# EAGLE design l293d (EAGLE 8.0.1)
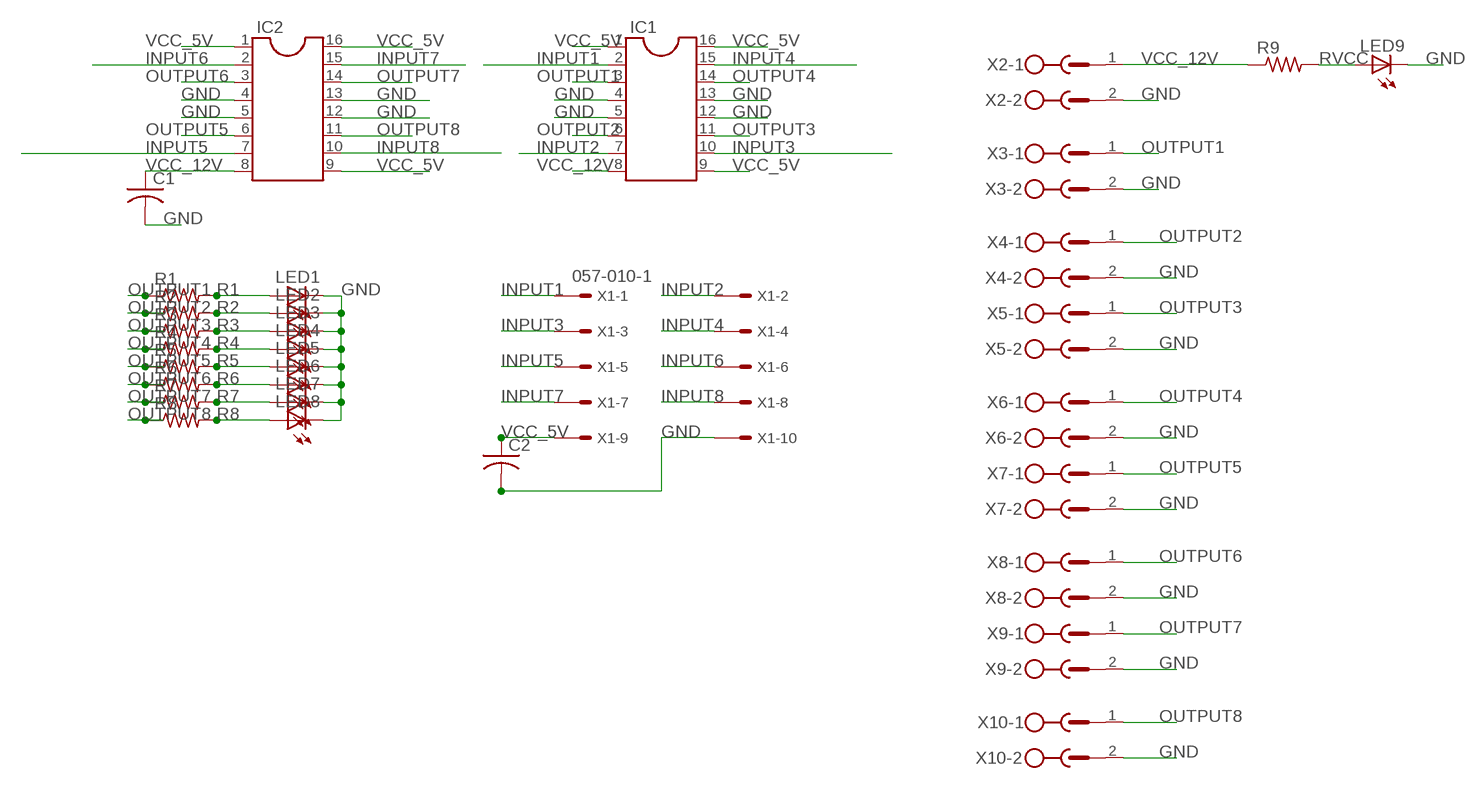
[diagram p0: schematic, sheet 1]

## Parts
C1  C-US050-025X075  [C050-025X075]
C2  C-US050-025X075  [C050-025X075]
IC1  DIL16S  [SOCKET-16]
IC2  DIL16S  [SOCKET-16]
LED1  LED3MM  [LED3MM]
LED2  LED3MM  [LED3MM]
LED3  LED3MM  [LED3MM]
LED4  LED3MM  [LED3MM]
LED5  LED3MM  [LED3MM]
LED6  LED3MM  [LED3MM]
LED7  LED3MM  [LED3MM]
LED8  LED3MM  [LED3MM]
LED9  LED3MM  [LED3MM]
R1  R-US_0204/7  [0204/7]
R2  R-US_0204/7  [0204/7]
R3  R-US_0204/7  [0204/7]
R4  R-US_0204/7  [0204/7]
R5  R-US_0204/7  [0204/7]
R6  R-US_0204/7  [0204/7]
R7  R-US_0204/7  [0204/7]
R8  R-US_0204/7  [0204/7]
R9  R-US_0204/7  [0204/7]
X1  057-010-1  [057-010-1]
X2  MSTBV2  [MSTBV2]
X3  MSTBV2  [MSTBV2]
X4  MSTBV2  [MSTBV2]
X5  MSTBV2  [MSTBV2]
X6  MSTBV2  [MSTBV2]
X7  MSTBV2  [MSTBV2]
X8  MSTBV2  [MSTBV2]
X9  MSTBV2  [MSTBV2]
X10  MSTBV2  [MSTBV2]

## Nets
GND: C1.2 C2.2 IC1.4 IC1.5 IC1.12 IC1.13 IC2.4 IC2.5 IC2.12 IC2.13 LED1.K(C) LED2.K(C) LED3.K(C) LED4.K(C) LED5.K(C) LED6.K(C) LED7.K(C) LED8.K(C) LED9.K(C) X1.10 X2.2 X3.2 X4.2 X5.2 X6.2 X7.2 X8.2 X9.2 X10.2
INPUT1: IC1.2 X1.1
INPUT2: IC1.7 X1.2
INPUT3: IC1.10 X1.3
INPUT4: IC1.15 X1.4
INPUT5: IC2.7 X1.5
INPUT6: IC2.2 X1.6
INPUT7: IC2.15 X1.7
INPUT8: IC2.10 X1.8
OUTPUT1: IC1.3 R1.1 X3.1
OUTPUT2: IC1.6 R2.1 X4.1
OUTPUT3: IC1.11 R3.1 X5.1
OUTPUT4: IC1.14 R4.1 X6.1
OUTPUT5: IC2.6 R5.1 X7.1
OUTPUT6: IC2.3 R6.1 X8.1
OUTPUT7: IC2.14 R7.1 X9.1
OUTPUT8: IC2.11 R8.1 X10.1
R1: LED1.A R1.2
R2: LED2.A R2.2
R3: LED3.A R3.2
R4: LED4.A R4.2
R5: LED5.A R5.2
R6: LED6.A R6.2
R7: LED7.A R7.2
R8: LED8.A R8.2
RVCC: LED9.A R9.2
VCC_5V: C2.1 IC1.1 IC1.9 IC1.16 IC2.1 IC2.9 IC2.16 X1.9
VCC_12V: C1.1 IC1.8 IC2.8 R9.1 X2.1

## Library data of the parts
C1 C2 = rcl:C-US: CAPACITOR, American symbol
IC1 IC2 = ic-package:DIL16: Dual In Line / Socket
LED1-LED9 = led:LED: LED OSRAM: - CHIPLED LG R971, LG N971, LY N971, LG Q971, LY Q971, LO R971, LY R971 LH N974, LH R974 LS Q976, LO Q976, LY Q976 LO Q996 - Hyper CHIPLED LW Q18S LB Q993, LB Q99A, LB R99A - SideLED LS A670, LO A670, LY A670, LG A670, LP A670 LB A673, LV A673, LT A673, LW A673 LH A674 LY A675 LS A676, LA A676, LO A676, LY A676, LW A676 LS A679, LY A679, LG A679 - Hyper Micro SIDELED® LS Y876, LA Y876, LO Y876, LY Y876 LT Y87S - SmartLED LW L88C, LW L88S LB L89C, LB L89S, LG L890 LS L89K, LO L89K, LY L89K LS L896, LA L896, LO L896, LY L896 - TOPLED LS T670, LO T670, LY T670, LG T670, LP T670 LSG T670, LSP T670, LSY T670, LOP T670, LYG T670 LG T671, LOG T671, LSG T671 LB T673, LV T673, LT T673, LW T673 LH T674 LS T676, LA T676, LO T676, LY T676, LB T676, LH T676, LSB T676, LW T676 LB T67C, LV T67C, LT T67C, LS T67K, LO T67K, LY T67K, LW E67C LS E67B, LA E67B, LO E67B, LY E67B, LB E67C, LV E67C, LT E67C LW T67C LS T679, LY T679, LG T679 LS T770, LO T770, LY T770, LG T770, LP T770 LB T773, LV T773, LT T773, LW T773 LH T774 LS E675, LA E675, LY E675, LS T675 LS T776, LA T776, LO T776, LY T776, LB T776 LHGB T686 LT T68C, LB T68C - Hyper Mini TOPLED® LB M676 - Mini TOPLED Santana® LG M470 LS M47K, LO M47K, LY M47K Source: http://www.osram.convergy.de LUXEON: - LUMILED® LXK2-PW12-R00, LXK2-PW12-S00, LXK2-PW14-U00, LXK2-PW14-V00 LXK2-PM12-R00, LXK2-PM12-S00, LXK2-PM14-U00 LXK2-PE12-Q00, LXK2-PE12-R00, LXK2-PE12-S00, LXK2-PE14-T00, LXK2-PE14-U00 LXK2-PB12-K00, LXK2-PB12-L00, LXK2-PB12-M00, LXK2-PB14-N00, LXK2-PB14-P00, LXK2-PB14-Q00 LXK2-PR12-L00, LXK2-PR12-M00, LXK2-PR14-Q00, LXK2-PR14-R00 LXK2-PD12-Q00, LXK2-PD12-R00, LXK2-PD12-S00 LXK2-PH12-R00, LXK2-PH12-S00 LXK2-PL12-P00, LXK2-PL12-Q00, LXK2-PL12-R00 Source: www.luxeon.com KINGBRIGHT: KA-3528ASYC Source: www.kingbright.com
R1-R9 = rcl:R-US_: RESISTOR, American symbol
X1 = con-panduit:057-010-: CONNECTOR 10-pin series 057 contact pc board low profile headers; OC_FARNELL: unknown; OC_NEWARK: unknown
X2-X10 = con-phoenix-500:MSTBV2: PHOENIX; OC_FARNELL: unknown; OC_NEWARK: unknown

## Board
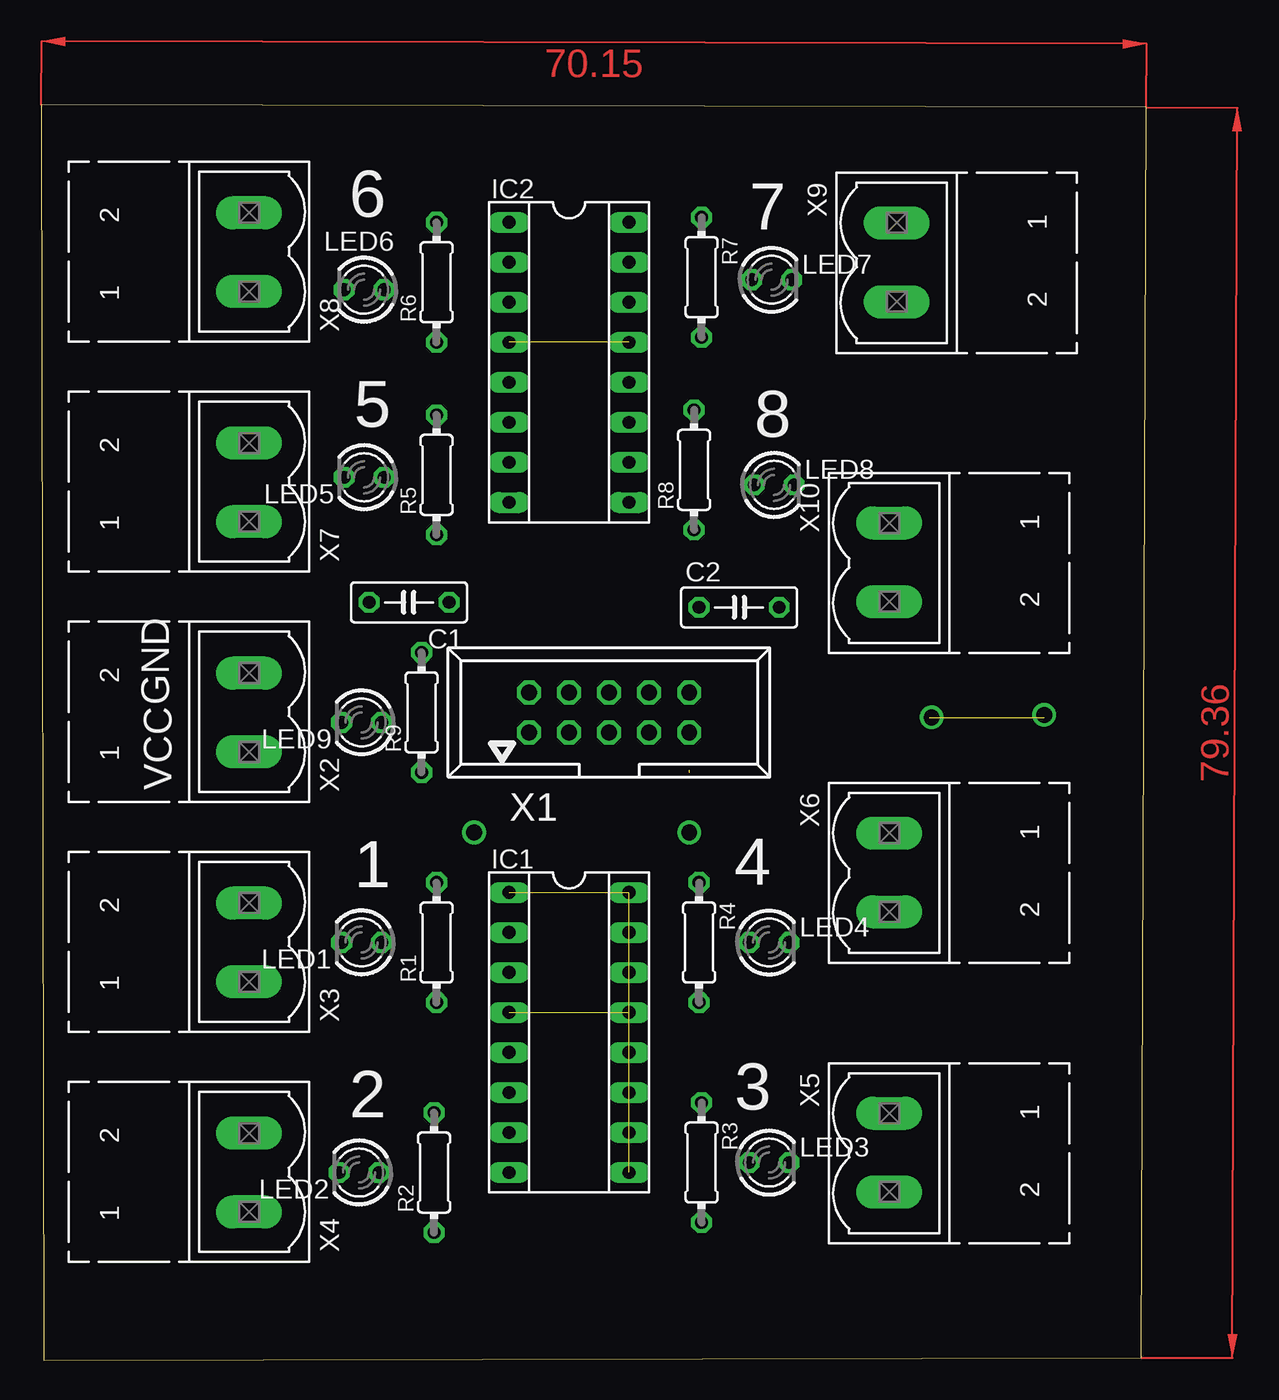
[diagram p1: board, top side]
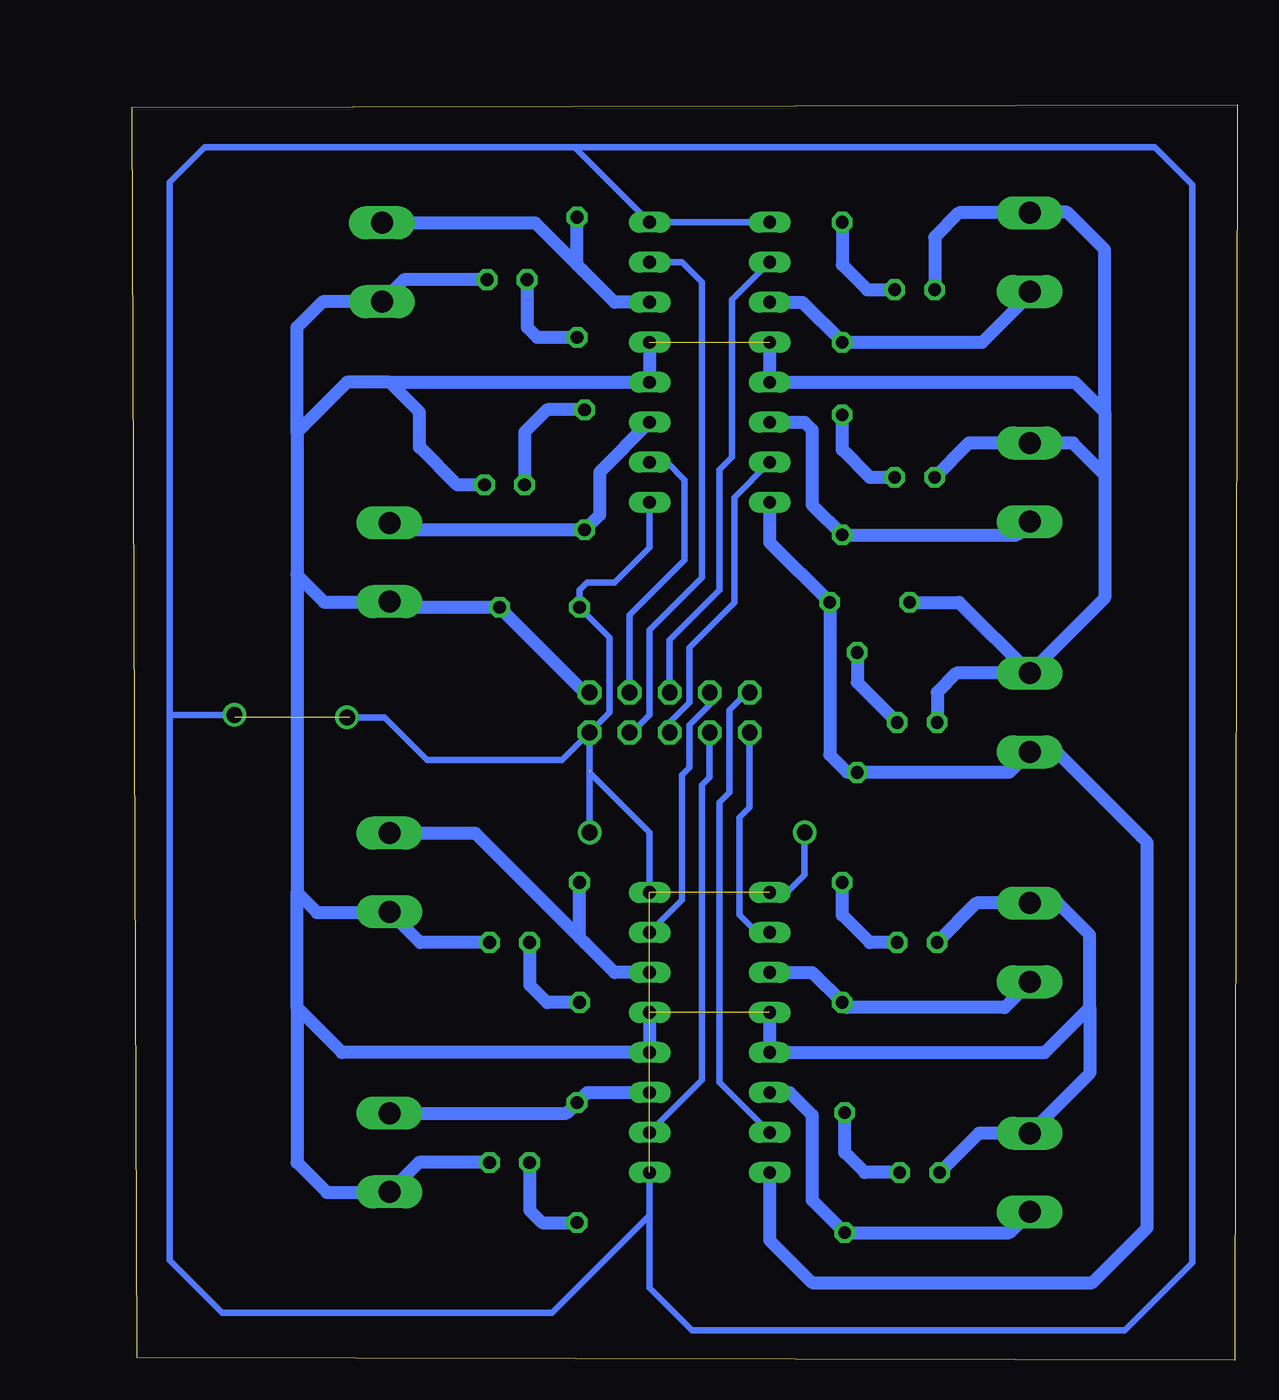
[diagram p2: board, bottom side, seen from below]

Size 70.15 x 79.68 mm. Coordinates in mm from the lower left corner, seen from the top.
Outline: 0.16,0 69.83,0.16 70.15,79.52 0,79.68 0.16,0
Copper layers (1*16): Top 0.035mm / dielectric 1.5mm / Bottom 0.035mm
Design rules "default": minimum track width 10mil, minimum drill 24mil, track to track 8mil, track to pad 8mil, pad to pad 8mil, via to via 8mil, smd to smd 8mil, copper to edge 40mil, drill to drill 8mil, minimum pad ring 10mil, minimum via ring 8mil, stop-mask expansion 4mil, vias tented up to drill 0mil, thermal gap 10mil

### Footprints (pad centres in the part's own frame; a part is rotated, then mirrored left to right if it is on the bottom)
C050-025X075 = drill 0.813 octagon: 1 -2.54,0; 2 2.54,0
SOCKET-16 = drill 0.813 long: 1 -8.89,-3.81; 2 -6.35,-3.81; 3 -3.81,-3.81; 4 -1.27,-3.81; 5 1.27,-3.81; 6 3.81,-3.81; 7 6.35,-3.81; 8 8.89,-3.81; 9 8.89,3.81; 10 6.35,3.81; 11 3.81,3.81; 12 1.27,3.81; 13 -1.27,3.81; 14 -3.81,3.81; 15 -6.35,3.81; 16 -8.89,3.81
LED3MM = drill 0.813 octagon: A -1.27,0; K 1.27,0
0204/7 = drill 0.813 octagon: 1 -3.81,0; 2 3.81,0
057-010-1 = drill 1 octagon: 1 -5.08,-1.27; 2 -5.08,1.27; 3 -2.54,-1.27; 4 -2.54,1.27; 5 0,-1.27; 6 0,1.27; 7 2.54,-1.27; 8 2.54,1.27; 9 5.08,-1.27; 10 5.08,1.27
MSTBV2 = drill 1.397 long: 1 -2.5,0; 2 2.5,0

### Placement (x,y rotation side)
C1  23.34,48.1 180 top
C2  44.29,47.78 0 top
IC1  33.5,20.8 270 top
IC2  33.5,63.34 270 top
LED1  20.32,26.51 180 top
LED2  20.16,11.91 180 top
LED3  46.2,12.54 0 top
LED4  46.2,26.51 0 top
LED5  20.48,56.04 180 top
LED6  20.48,67.95 180 top
LED7  46.35,68.58 0 top
LED8  46.51,55.56 0 top
LED9  20.32,40.48 180 top
R1  25.08,26.51 90 top
R2  24.92,11.91 90 top
R3  41.91,12.54 270 top
R4  41.75,26.51 270 top
R5  25.08,56.2 90 top
R6  25.08,68.42 90 top
R7  41.91,68.74 270 top
R8  41.43,56.52 90 top
R9  24.13,41.12 90 top
X1  36.04,41.12 0 top
X2  13.18,41.12 90 top
X3  13.18,26.51 90 top
X4  13.18,11.91 90 top
X5  53.82,13.18 270 top
X6  53.82,30.96 270 top
X7  13.18,55.72 90 top
X8  13.18,70.33 90 top
X9  54.29,69.69 270 top
X10  53.82,50.64 270 top

### Tracks (layer width: path | path; a pad name or v marks a point on that pad's centre or on a via)
GND  (2 unrouted)
  Bottom 0.813: IC2.4 IC2.5 10.32,62.07 8.41,60.17 | IC2.13 IC2.12 53.82,62.07 | IC1.4 IC1.5 12.22,19.53 9.37,22.38 | IC1.13 IC1.12 56.83,19.53 59.69,22.38 | X2.2 17.82,43.62 19.05,42.39 LED9.K | C1.2 17.66,48.1 X2.2 | 8.41,56.2 10.44,58.22 X7.2 17.03,58.22 LED5.K | 8.41,56.2 8.41,48.38 X2.2 | 8.41,60.17 8.41,56.2 | 8.41,60.17 8.41,70.49 10.8,72.87 13.14,72.87 X8.2 17.66,72.83 19.21,71.28 LED6.K | 59.69,58.9 59.69,65.56 58.06,67.19 X9.2 52.9,68.58 LED7.K | 59.69,58.9 59.69,49.85 | 59.69,49.85 57.94,48.1 55.09,48.1 | 55.09,48.1 53.86,48.1 X10.2 | 53.82,62.07 56.52,62.07 59.69,58.9 | 59.69,49.85 59.69,29.69 | 59.69,29.69 58.42,28.42 53.86,28.42 X6.2 51.87,26.51 LED4.K | 59.69,22.38 59.69,29.69 | 59.69,22.38 59.69,12.54 57.79,10.64 53.86,10.64 X5.2 51.95,12.54 LED3.K | 9.37,22.38 9.37,26.99 11.39,29.01 X3.2 16.55,29.01 LED1.K | 9.37,22.38 9.37,18.22 X4.2 16.39,14.41 LED2.K | LED8.K 49.53,55.56 51.91,57.94 51.91,60.17 53.82,62.07 | 55.09,48.1 54.77,47.78 C2.2 41.43,42.39 X1.10
INPUT1
  Bottom 0.406: X1.1 30.96,35.08 31.59,34.45 31.59,28.26 30.48,27.15 IC1.2
INPUT2
  Bottom 0.406: X1.2 31.12,42.39 32.23,41.28 32.23,36.04 32.86,35.4 32.86,17.62 32.07,16.83 | 32.07,16.83 32.39,17.15 | 32.07,16.83 IC1.7
INPUT3
  Bottom 0.406: X1.3 33.5,36.99 33.97,36.51 33.97,17.78 IC1.10
INPUT4
  Bottom 0.406: 33.66,42.39 X1.4 33.5,41.59 34.77,40.32 34.77,37.62 35.24,37.15 35.24,29.21 IC1.15
INPUT5
  Bottom 0.406: X1.5 36.04,40.48 34.77,41.75 34.77,45.24 31.91,48.1 31.91,54.77 IC2.7
INPUT6
  Bottom 0.406: X1.6 36.04,45.72 32.86,48.9 32.86,56.52 32.07,57.31 32.07,67.31 IC2.2
INPUT7
  Bottom 0.406: X1.7 38.42,39.85 37.31,40.96 37.31,46.36 33.97,49.69 33.97,68.42 35.24,69.69 IC2.15
INPUT8
  Bottom 0.406: IC2.10 36.2,56.99 35.08,55.88 35.08,50.8 38.58,47.31 X1.8
N$1  (via drill 1)
  other vias: 41.12,33.5
N$2  (via drill 1)
  other vias: 27.46,33.5
N$3  (via drill 1)
  other vias: 56.52,40.8
N$4  (via drill 1)
  other vias: 63.66,40.96
OUTPUT1
  Bottom 0.813: X3.1 13.18,23.97 14.76,22.38 24.77,22.38 R1.1 26.99,24.61 IC1.3
OUTPUT2
  Bottom 0.813: IC1.6 28.42,16.99 26.99,15.56 26.99,10.16 R2.1 14.49,8.1 X4.1
OUTPUT3
  Bottom 0.813: 41.28,16.99 IC1.11 | 41.28,16.99 R3.1 | X5.1 42.59,15.68 41.28,16.99
OUTPUT4
  Bottom 0.813: IC1.14 39.53,24.61 41.43,26.51 | 41.43,26.51 41.75,26.83 R4.1 | X6.1 48.38,33.46 41.43,26.51
OUTPUT5
  Bottom 0.813: IC2.6 27.46,59.53 26.99,59.06 26.99,54.29 R5.1 14.01,52.39 X7.1
OUTPUT6
  Bottom 0.813: X8.1 13.18,67.63 16.19,64.61 R6.1 27.62,67.15 IC2.3
OUTPUT7
  Bottom 0.813: IC2.14 39.53,67.15 41.59,69.22 | 41.59,69.22 41.91,69.53 R7.1 | X9.1 44.57,72.19 41.59,69.22
OUTPUT8
  Bottom 0.813: IC2.11 40.48,56.36 40.48,53.66 R8.1 53.38,52.71 X10.1
R1
  Bottom 0.813: LED1.A 23.34,26.51 25.08,28.26 R1.2
R2
  Bottom 0.813: LED2.A 23.65,11.91 24.92,13.18 R2.2
R3
  Bottom 0.813: LED3.A 44.93,9.53 44.13,8.73 R3.2
R4
  Bottom 0.813: LED4.A 44.93,23.81 43.82,22.7 R4.2
R5
  Bottom 0.813: LED5.A 23.34,56.04 25.08,57.79 R5.2
R6
  Bottom 0.813: R6.2 25.08,69.53 23.5,67.95 LED6.A
R7
  Bottom 0.813: LED7.A 45.09,65.56 44.45,64.93 R7.2
R8
  Bottom 0.813: R8.2 43.82,60.33 45.24,58.9 LED8.A
RVCC
  Bottom 0.813: R9.2 24.13,43.02 LED9.A
VCC_5V  (4 unrouted)
  Bottom 0.406: X1.9 39.85,41.12 39.85,45.88 C2.1 41.75,48.9 41.28,49.37 39.53,49.37 37.31,51.59 IC2.9 | X1.9 41.12,37.31 37.31,33.5 IC1.16 | 37.31,9.21 43.5,3.02 64.45,3.02 67.79,6.35 67.79,74.77 65.56,76.99 42.07,76.99 | 37.31,9.21 IC1.9 | 42.07,76.99 IC2.16 IC2.1 | 42.07,76.99 5.24,76.99 2.86,74.61 2.86,6.19 7.14,1.91 34.61,1.91 37.31,4.6 37.31,9.21 | IC1.1 28.58,29.69 27.46,30.8 27.46,33.34 | 41.12,37.47 41.12,33.5 | X1.9 42.86,38.1 51.44,38.1 54.13,40.8 56.36,40.8 | 67.79,40.96 63.82,40.96 63.66,40.8
VCC_12V
  Bottom 0.813: 6.11,33.26 11.47,38.62 X2.1 14.49,37.31 R9.1 24.77,37.31 25.88,38.42 C1.1 29.69,51.91 IC2.8 | 6.11,33.26 5.72,32.86 | 29.53,11.75 IC1.8 29.69,7.62 26.99,4.92 9.21,4.92 5.72,8.41 5.72,32.86 | 5.72,32.86 6.11,33.26
(copper drawn outside any net)
  shapes: Top area x2

### Text on the board
tNames: 6 | 7 | 5 | 8 | GND | VCC | 1 | 4 | 2 | 3